# Altium schematic sheet Power_and_Control.SchDoc: Power & Control
size A4; DrawnBy: M. Small & J. Wilson; SheetNumber: 4; SheetTotal: 10
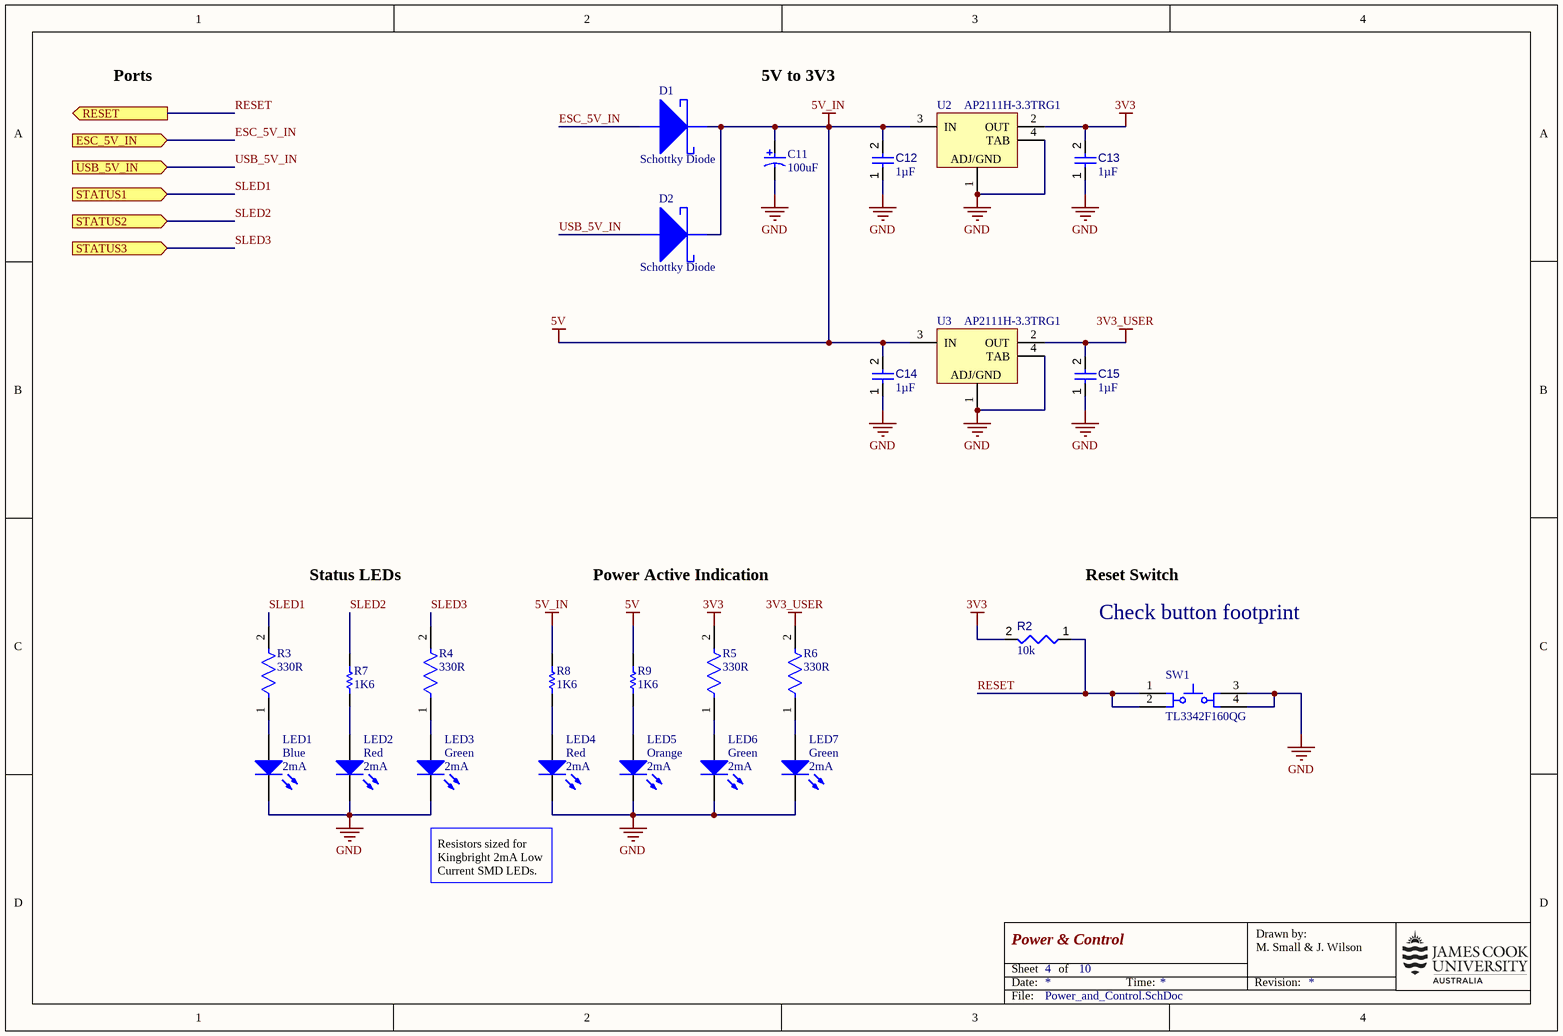
[diagram p0: Power_and_Control.SchDoc]

## Parts
C11  100uF  [PNSC-FP-V-D8_V]
C12  value 1µF  [CAPC0805(2012)145_L]  (hidden comment: Capacitor 1µF +/-20% 25V 0805)
C13  value 1µF  [CAPC0805(2012)145_L]  (hidden comment: Capacitor 1µF +/-20% 25V 0805)
C14  value 1µF  [CAPC0805(2012)145_L]  (hidden comment: Capacitor 1µF +/-20% 25V 0805)
C15  value 1µF  [CAPC0805(2012)145_L]  (hidden comment: Capacitor 1µF +/-20% 25V 0805)
D1  Schottky Diode  [DO-221BC]
D2  Schottky Diode  [DO-221BC]
LED1  Blue  IF: 2mA  [1206_A]
LED2  Red  IF: 2mA  [1206_A]
LED3  Green  IF: 2mA  [1206_A]
LED4  Red  IF: 2mA  [1206_A]
LED5  Orange  IF: 2mA  [1206_A]
LED6  Green  IF: 2mA  [1206_A]
LED7  Green  IF: 2mA  [1206_A]
R2  value 10k  [RESC0805(2012)_L]  (hidden comment: Resistor 10K +/-5% 0805 125 mW)
R3  330R  [FP-CRCW0805-e3-MFG]
R4  330R  [FP-CRCW0805-e3-MFG]
R5  330R  [FP-CRCW0805-e3-MFG]
R6  330R  [FP-CRCW0805-e3-MFG]
R7  1K6  [RESC2013X50X30LL20T20]
R8  1K6  [RESC2013X50X30LL20T20]
R9  1K6  [RESC2013X50X30LL20T20]
SW1  TL3342F160QG  [ESWI-TL3342F160QG_V]
U2  AP2111H-3.3TRG1  [ONSC-SOT-223-4-318H-01_A_V]
U3  AP2111H-3.3TRG1  [ONSC-SOT-223-4-318H-01_A_V]

## Ports
ESC_5V_IN (in), RESET (out), STATUS1 (in), STATUS2 (in), STATUS3 (in), USB_5V_IN (in)

## Nets
3V3: C13.2 R2.2 R5.2 U2.2(OUT)
3V3_USER: C15.2 R6.2 U3.2(OUT)
5V: C11.1 C12.2 C14.2 D1.1 D2.1 R8.2 R9.2 U2.3(IN) U3.3(IN)  [also labelled 5V_IN]
GND: C11.2 C12.1 C13.1 C14.1 C15.1 LED1.1(K) LED2.1(K) LED3.1(K) LED4.1(K) LED5.1(K) LED6.1(K) LED7.1(K) SW1.3 SW1.4 U2.1(ADJ/GND) U2.4(TAB) U3.1(ADJ/GND) U3.4(TAB)
ESC_5V_IN: D1.2 ; port ESC_5V_IN
RESET: R2.1 SW1.1 SW1.2 ; port RESET
SLED1: R3.2 ; port STATUS1
SLED2: R7.2 ; port STATUS2
SLED3: R4.2 ; port STATUS3
USB_5V_IN: D2.2 ; port USB_5V_IN
NetLED1_2: LED1.2(A) R3.1
NetLED2_2: LED2.2(A) R7.1
NetLED3_2: LED3.2(A) R4.1
NetLED4_2: LED4.2(A) R8.1
NetLED5_2: LED5.2(A) R9.1
NetLED6_2: LED6.2(A) R5.1
NetLED7_2: LED7.2(A) R6.1

## Notes on the sheet
- Ports
- 5V to 3V3
- Status LEDs
- Power Active Indication
- Reset Switch
- Check button footprint
- Resistors sized for Kingbright 2mA Low Current SMD LEDs.
- Date:
- Sheet
- of
- Time:
- Revision:
- Drawn by:
- File:

## Library data of the parts
C11 = CMP-2000-06217-1: Aluminum Electrolytic Capacitor, 100 uF, +/- 20%, 25 V, 2-Pin SMD (Size Code D8), -55 to 105 degC, RoHS, Tape and Reel; Manufacturer: Panasonic; Capacitance: 100µF; Product Range: PANASONIC-FPSeries; SVHC: ToBeAdvised; Ripple Current AC: 600mA; Voltage Rating: 25V; ESR: 0.16ohm; Lifetime @ Temperature: 2000hours@105°C; External Length / Height: 7.7mm; Leakage Current: 25µA; Capacitor Case Style: RadialCan-SMD; Capacitance Tolerance ±: ±20%; Mounting Technology: SurfaceMount; Series: FP; Packaging: CutTape; Operating Temperature Max: 105°C; Height: 7.7mm; Manufacturer URL: http://www.panasonic.com/; Datasheet Version: 03/2016; Capacitance Tolerance: ±20%; Package Reference: PNSC-FP-V-D8; Operating Temperature Range: -55°Cto+105°C; Operating Temperature Min: -55°C; Package Description: 2-Pin Electrolytic Aluminum Capacitor, Body 6.6 x 6.6 mm; Datasheet URL: http://industrial.panasonic.com/cdbs/www-data/pdf/RDE0000/ABA0000C1184.pdf; Package URL: http://industrial.panasonic.com/cdbs/www-data/pdf/RDE0000/DME0000COL48.pdf; Diameter: 6.3mm; Life Time @ Temperature: 2000hours@105°C; AE Capacitor Case: RadialCan-SMD
C12-C15 = CMP-001-00079-2: Chip Capacitor, 1µF +/-20%, 25V, 0805, Thickness 1.45 mm; Tolerance: 10%; Pins: 2; Max Operating Temperature: 85°C; Mounting Technology: SMT; Case/Package: 0805; Voltage Rating: 25V; Min Operating Temperature: -55°C
D1 D2 = Schottky 2 pin 8A: Small Signal Schottky Diode, Single, 45 V, 8 A, 570 mV; Manufacturer P/N: V8PAL45-M3/I; Supplier 1: Element14; Supplier Part Number 1: 2425092; DatasheetURL: http://www.farnell.com/datasheets/2049270.pdf
LED1 = CMP-1426-00015-1: KPT-3216LVVBC-D -  LED, 3.2mm x 1.6mm, Blue, SMD, 2 mA, 2.65 V, 470 nm; Manufacturer: Kingbright; ComponentLink2Description: Datasheet; PartNumber: KPT-3216LVVBC-D; ComponentLink1Description: Manufacturer URL; ComponentLink2URL: http://www.farnell.com/datasheets/2068439.pdf; PackageReference: 1206_A; Color: Blue; Element14 Order Code: 2610425
LED2 LED4 = CMP-1426-00013-1: KPT-3216LVSECK-J3-PRV -  LED, 3.2mm x 1.6mm, Red, SMD, 2 mA, 1.8 V, 625 nm; Manufacturer: Kingbright; ComponentLink2URL: http://www.farnell.com/datasheets/2068435.pdf; ComponentLink2Description: Datasheet; ComponentLink1Description: Manufacturer URL; PartNumber: KPT-3216LVSECK-J3-PRV; PackageReference: 1206_A; Element14 Order Code: 2610421
LED3 LED6 LED7 = CMP-1426-00014-1: KPT-3216LVZGCK -  LED, 3.2mm x 1.6mm, Green, SMD, 2 mA, 2.65 V, 525 nm; Manufacturer: Kingbright; PackageReference: 1206_A; PartNumber: KPT-3216LVZGCK; ComponentLink1Description: Manufacturer URL; ComponentLink2URL: http://www.farnell.com/datasheets/2068438.pdf; ComponentLink2Description: Datasheet; Color: Green; Element14 Order Code: 2610424
LED5 = CMP-1426-00019-1: APT3216LSECK/J4-PRV -  LED, 3.2mm x 1.6mm, Orange, SMD, 2 mA, 1.8 V, 590 nm; PartNumber: KPT-3216LVSYCK-J3-PRV; Manufacturer: Kingbright; Color: Yellow; ComponentLink2URL: http://www.farnell.com/datasheets/2068437.pdf; ComponentLink1Description: Manufacturer URL; PackageReference: 1206_A; ComponentLink2Description: Datasheet; Element14 Order Code: 2610423
R2 = CMP-009-00118-2: Chip Resistor, 10 kOhms, +/-5%, 125 mW, -55 to 155 degC, 0805; Power: 125mW; Tolerance: 5%; Max Operating Temperature: 155°C; Min Operating Temperature: -55°C; Pins: 2; Case/Package: 0805
R3-R6 = CMP-2001-03823-2: RES Thick Film, 330Ω, 1%, 0.125W, 100ppm/°C, 0805; Voltage Rating (DC): 150V; Max Power Dissipation: 125mW; Mount: Surface Mount; Packaging: Tape and Reel; Min Operating Temperature: -55°C; Resistance: 330R; Military Standard: Not; Case Code (Metric): 2012; Height: 0.02inch; Voltage Rating: 150V; Case/Package: 0805; Max Operating Temperature: 155°C; Width: 0.049inch; Case Code (Imperial): 0805; Termination: SMD/SMT; Lead Free: Lead Free; Contact Plating: Tin; Package Quantity: 10; Composition: Thick Film; Length: 2mm; Features: Automotive AEC-Q200; Depth: 1.25mm; Weight: 0.000194oz; Tolerance: 1%; Power Rating: 125mW; Number of Terminations: 2; Temperature Coefficient: 100ppm/°C
R7-R9 = CMP-1013-00531-2: Part Number: CRCW08051K60FKEA; Manufacturer: Vishay Dale
SW1 = CMP-011-00008-1: Tactile Switch, SPST-NO, 50 mA, 12 V, 4-Pin SMD, RoHS, Tape and Reel; Manufacturer: E-Switch; Operating Force: 1.6N; Throw Configuration: SPST; Max Voltage Rating (DC): 12V; Current Rating: 50mA; Datasheet URL: http://spec_sheets.e-switch.com/specs/P010632.pdf; Mounting Technology: SM; Manufacturer URL: http://www.e-switch.ch/en/; Contact Plating: Silver; Datasheet Version: Rev. I, 12/2010; Package Quantity: 3000; Package Reference: TL3342F160QG; RoHS Compliant: True; Package Description: 4-Pin Surface Mount Device, Body 5 x 5 mm, Pitch 6.3 mm; Case/Package: TL3342F160QG; Packaging: TapeandReel; Voltage Rating (DC): 12V; Contact Material: Silver
U2 U3 = CMP-019-00030-2: Low-Dropout Positive Fixed Voltage Regulator, 1 A, 3.3 V Output Voltage, 0 to 125 degC, 4-Pin SOT-223 (318H-01), Pb-Free, Tape and Reel; Manufacturer: ON Semiconductor; Nominal Output Voltage: 3.3V; Min Supply Voltage: 4.75V; Outputs: 1; Max Ouput Current: 1A; Dropout Voltage: 1.1V; Max Supply Voltage: 15V; Max Input Voltage: 20V; Min Input Voltage: 3.5V; Package Description: 4-Pin Small Outline Transistor, Body 6.5 x 3.5 mm, Pitch 2.3 mm; Datasheet Version: Rev. 27, 09/2014; Package Quantity: 4000; Mounting Technology: SM; Datasheet URL: http://www.onsemi.com/pub_link/Collateral/NCP1117-D.PDF; Output Voltage: 3.3V; Manufacturer URL: http://www.onsemi.com/; Output Current: 1A; Min Operating Temperature: 0°C; Package Reference: SOT-223-4-318H-01_A; Max Operating Temperature: 125°C; Pins: 3; Packaging: TapeandReel; Case/Package: SOT-223-4; RoHS Compliant: True